# EAGLE design icehax40 (EAGLE 9.6.2)
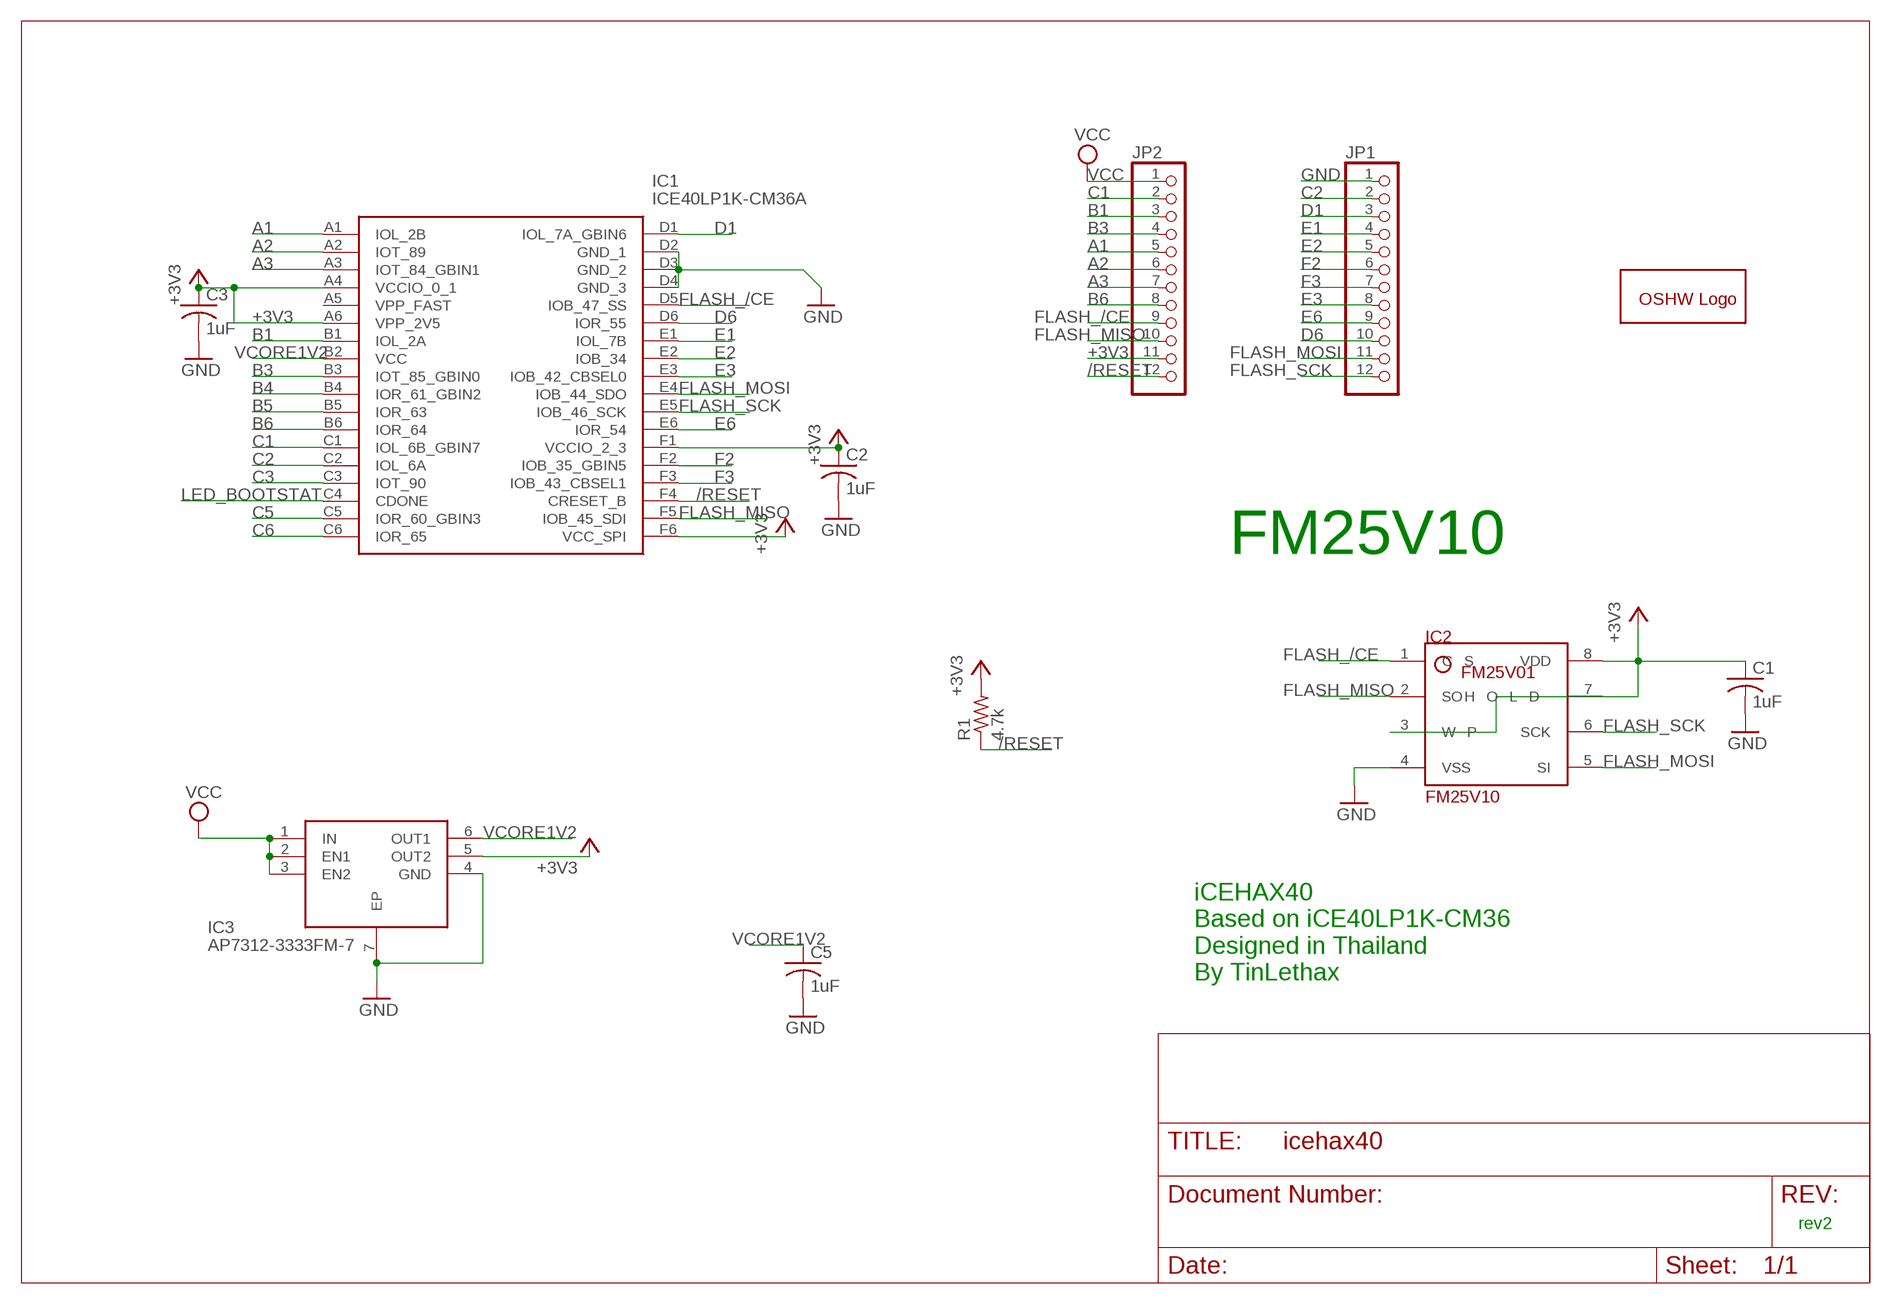
[diagram p0: schematic, sheet 1]

## Parts
C1  1uF  C-USC0603  [C0603]
C2  1uF  C-USC0603  [C0603]
C3  1uF  C-USC0603  [C0603]
C5  1uF  C-USC0603  [C0603]
GOLD_ORB_SM1  OSHWLOGOLOGO5MM  [OSHW_5MM]
IC1  ICE40LP1K-CM36A  [BGA36C40P6X6_250X250X100]
IC2  FM25V10  FM25V01  [SOIC127P601X172-8N]
IC3  AP7312-3333FM-7  [SON50P201X181X60-7N]
JP1  PINHD-1X12  [1X12]
JP2  PINHD-1X12  [1X12]
R1  4.7k  R-US_R0603  [R0603]

## Nets
+3V3: C1.1 C2.1 C3.1 IC1.A4(VCCIO_0_1) IC1.A6(VPP_2V5) IC1.F1(VCCIO_2_3) IC1.F6(VCC_SPI) IC2.3(W̅P̅) IC2.7(H̅O̅L̅D̅) IC2.8(VDD) IC3.5(OUT2) JP2.11 R1.2
/RESET: IC1.F4(CRESET_B) JP2.12 R1.1
A1: IC1.A1(IOL_2B) JP2.5
A2: IC1.A2(IOT_89) JP2.6
A3: IC1.A3(IOT_84_GBIN1) JP2.7
B1: IC1.B1(IOL_2A) JP2.3
B3: IC1.B3(IOT_85_GBIN0) JP2.4
B4: IC1.B4(IOR_61_GBIN2)
B5: IC1.B5(IOR_63)
B6: IC1.B6(IOR_64) JP2.8
C1: IC1.C1(IOL_6B_GBIN7) JP2.2
C2: IC1.C2(IOL_6A) JP1.2
C3: IC1.C3(IOT_90)
C5: IC1.C5(IOR_60_GBIN3)
C6: IC1.C6(IOR_65)
D1: IC1.D1(IOL_7A_GBIN6) JP1.3
D6: IC1.D6(IOR_55) JP1.10
E1: IC1.E1(IOL_7B) JP1.4
E2: IC1.E2(IOB_34) JP1.5
E3: IC1.E3(IOB_42_CBSEL0) JP1.8
E6: IC1.E6(IOR_54) JP1.9
F2: IC1.F2(IOB_35_GBIN5) JP1.6
F3: IC1.F3(IOB_43_CBSEL1) JP1.7
FLASH_/CE: IC1.D5(IOB_47_SS) IC2.1(C̅S̅) JP2.9
FLASH_MISO: IC1.F5(IOB_45_SDI) IC2.2(SO) JP2.10
FLASH_MOSI: IC1.E4(IOB_44_SDO) IC2.5(SI) JP1.11
FLASH_SCK: IC1.E5(IOB_46_SCK) IC2.6(SCK) JP1.12
GND: C1.2 C2.2 C3.2 C5.2 IC1.D2(GND_1) IC1.D3(GND_2) IC1.D4(GND_3) IC2.4(VSS) IC3.4(GND) IC3.7(EP) JP1.1
LED_BOOTSTAT: IC1.C4(CDONE)
VCC: IC3.1(IN) IC3.2(EN1) IC3.3(EN2) JP2.1
VCORE1V2: C5.1 IC1.B2(VCC) IC3.6(OUT1)
Unconnected: IC1.A5(VPP_FAST)

## Notes on the sheet
- FM25V10
- iCEHAX40
  Based on iCE40LP1K-CM36
  Designed in Thailand
  By TinLethax
- rev2

## Library data of the parts
C1-C3 C5 = adafruit:C-US: CAPACITOR, American symbol
GOLD_ORB_SM1 = oshw:OSHWLOGO: The OSHW logo for PCB layout
IC1 = ICE40LP1K-CM36A:ICE40LP1K-CM36A: iCE40 LP/HX/LM - Low-power, high-performance FPGA Source: Datasheet <http://www.latticesemi.com/iCE40>; DESCRIPTION: iCE40 LP/HX/LM - Low-power, high-performance FPGA; HEIGHT: 1mm; MANUFACTURER_NAME: Lattice Semiconductor; MANUFACTURER_PART_NUMBER: ICE40LP1K-CM36A; MOUSER_PART_NUMBER: 842-ICE40LP1K-CM36A; MOUSER_PRICE-STOCK: https://www.mouser.co.uk/ProductDetail/Lattice/ICE40LP1K-CM36A?qs=w%2Fv1CP2dgqpOjceq4EogWg%3D%3D
IC2 = FM25V01:FM25V01: The FM25V01A is a 128-Kbit nonvolatile memory employing an advanced ferroelectric process. An F-RAM is nonvolatile and performs reads and writes similar to a RAM. It provides reliable data retention for 151 years while eliminating the complexities, overhead, and system-level reliability problems caused by serial flash, EEPROM, and other nonvolatile memories. Unlike serial flash and EEPROM, the FM25V01A performs write operations at bus speed. No write delays are incurred. Data is written to the memory array immediately after each byte is successfully transferred to the device. The next bus cycle can commence without the need for data polling. In addition, the product offers substantial write endurance compared with other nonvolatile memories. The FM25V01A is capable of supporting 1014 read/write cycles, or 100 million times more write cycles than EEPROM.; PARTNO: FM52V01
IC3 = AP7312-3333FM-7:AP7312-3333FM-7: LDO Voltage Regulators Dual 150mA LDO Reg 60uA 3.3 to 3.3 65dB Source: Datasheet <https://componentsearchengine.com/Datasheets/2/AP7312-3333FM-7.pdf>; ARROW_PART_NUMBER: AP7312-3333FM-7; ARROW_PRICE-STOCK: https://www.arrow.com/en/products/ap7312-3333fm-7/diodes-incorporated?region=nac; DESCRIPTION: LDO Voltage Regulators Dual 150mA LDO Reg 60uA 3.3 to 3.3 65dB; HEIGHT: 0.605mm; MANUFACTURER_NAME: Diodes Inc.; MANUFACTURER_PART_NUMBER: AP7312-3333FM-7; MOUSER_PART_NUMBER: 621-AP7312-3333FM-7; MOUSER_PRICE-STOCK: https://www.mouser.co.uk/ProductDetail/Diodes-Incorporated/AP7312-3333FM-7?qs=gfe7vQ8txpUN8cgNVhLSKw%3D%3D
JP1 JP2 = adafruit:PINHD-1X12: PIN HEADER
R1 = adafruit:R-US_: RESISTOR, American symbol

## Board
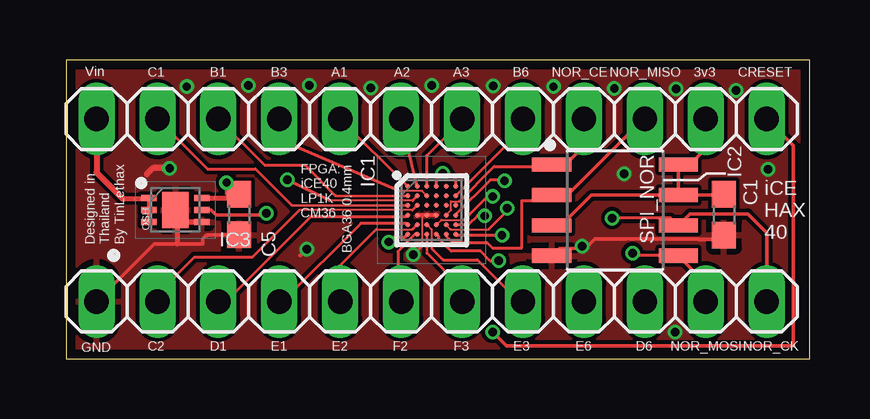
[diagram p1: board, top side]
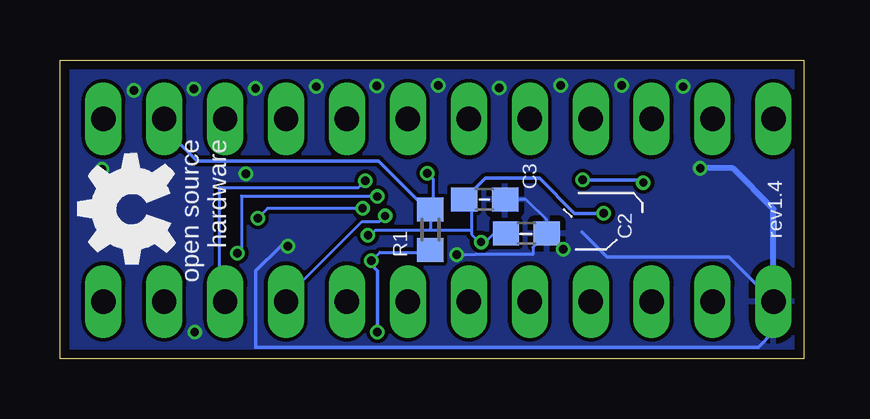
[diagram p2: board, bottom side, seen from below]

Size 31.02 x 12.46 mm. Coordinates in mm from the lower left corner, seen from the top.
Outline: 0,0 31.02,0 31.01,12.46 0,12.46 0,0
Copper layers (1*16): Top 0.035559375mm / dielectric 1.6mm / Bottom 0.035559375mm
Design rules "oshpark-2layer *": minimum track width 6mil, minimum drill 10mil, track to track 6mil, track to pad 6mil, pad to pad 6mil, via to via 6mil, smd to smd 6mil, copper to edge 15mil, drill to drill 6mil, minimum pad ring 5mil, minimum via ring 5mil, stop-mask expansion 0mil, vias tented up to drill 0mil, thermal gap 10mil

### Footprints (pad centres in the part's own frame; a part is rotated, then mirrored left to right if it is on the bottom)
C0603 = smd 1.1 x 1: 1 -0.85,0; 2 0.85,0
BGA36C40P6X6_250X250X100 = smd 0.2 x 0.2: A1 -1,1; A2 -0.6,1; A3 -0.2,1; A4 0.2,1; A5 0.6,1; A6 1,1; B1 -1,0.6; B2 -0.6,0.6; B3 -0.2,0.6; B4 0.2,0.6; B5 0.6,0.6; B6 1,0.6; C1 -1,0.2; C2 -0.6,0.2; C3 -0.2,0.2; C4 0.2,0.2; C5 0.6,0.2; C6 1,0.2; D1 -1,-0.2; D2 -0.6,-0.2; D3 -0.2,-0.2; D4 0.2,-0.2; D5 0.6,-0.2; D6 1,-0.2; E1 -1,-0.6; E2 -0.6,-0.6; E3 -0.2,-0.6; E4 0.2,-0.6; E5 0.6,-0.6; E6 1,-0.6; F1 -1,-1; F2 -0.6,-1; F3 -0.2,-1; F4 0.2,-1; F5 0.6,-1; F6 1,-1
SOIC127P601X172-8N = smd 1.641 x 0.602: 1 -2.637,1.905; 2 -2.637,0.635; 3 -2.637,-0.635; 4 -2.637,-1.905; 5 2.637,-1.905; 6 2.637,-0.635; 7 2.637,0.635; 8 2.637,1.905
SON50P201X181X60-7N = smd 0.65 x 0.25: 1 -1.1,0.5; 2 -1.1,0; 3 -1.1,-0.5; 4 1.1,-0.5; 5 1.1,0; 6 1.1,0.5 | smd 1.1 x 1.5: 7 0,0
1X12 = drill 1.016 long: 1 -13.97,0; 2 -11.43,0; 3 -8.89,0; 4 -6.35,0; 5 -3.81,0; 6 -1.27,0; 7 1.27,0; 8 3.81,0; 9 6.35,0; 10 8.89,0; 11 11.43,0; 12 13.97,0
R0603 = smd 1 x 1.1: 1 -0.85,0; 2 0.85,0

### Placement (x,y rotation side)
C1  27.43,6 270 top
C2  11.57,5.22 0 bottom
C3  13.31,6.65 0 bottom
C5  7.21,6.01 270 top
GOLD_ORB_SM1  28.02,6.24 90 bottom
IC1  15.24,6.19 0 top
IC2  22.89,6.19 0 top
IC3  4.56,6.2 0 top
JP1  15.24,2.38 0 top
JP2  15.24,10 0 top
R1  15.57,5.38 90 bottom

### Tracks (layer width: path | path; a pad name or v marks a point on that pad's centre or on a via)
+3V3  (via drill 0.35)
  Top 0.127: IC1.F6 16.3,5.13 18.15,5.13 v18.17,5.16 | v13.46,4.87 13.68,5.08 14.13,5.08 IC1.F1 | IC1.A4 15.44,7.48 v15.7,7.74 15.97,7.74 16.24,7.47 IC1.A6
  Top 0.152: IC2.3 20.33,5.64 20.72,5.64 21.91,6.83 IC2.7 | IC2.7 IC2.8 26.01,8.1 26.61,8.69 | IC2.7 27.41,6.83 C1.1 | 26.61,9.94 JP2.11 | IC3.5 6.06,6.2 6.26,6 8.28,6 v8.34,6.06
  Top 0.254: 26.61,9.94 26.61,8.69
  Bottom 0.127: v18.17,5.16 18.07,5.16 17.87,5.36 15.52,5.36 | 15.52,5.36 13.85,5.36 | v15.7,7.74 15.47,7.51 15.47,6.33 R1.2 15.57,5.41 15.52,5.36 | C3.1 13.85,6.34 13.85,5.36 | 13.85,5.36 13.85,5.18 13.54,4.87 v13.46,4.87 13.28,4.87 12.93,5.22 C2.1
  Bottom 0.152: R1.2 15.71,6.23 17.73,8.25 25.3,8.25 26.67,9.62 JP2.11 | v8.34,6.06 9.56,6.06 11.02,7.52 13.28,7.52 C3.1
/RESET  (via drill 0.35)
  Top 0.127: IC1.F4 15.52,5.11 15.52,5.02 16.05,4.49 17.27,4.49 17.68,4.08 v18.03,4.08
  Top 0.152: JP2.12 30.33,8.88 30.33,0.53 18.36,0.53 v17.78,1.11
  Bottom 0.127: v18.03,4.08 17.68,4.44 15.66,4.44 R1.1
  Bottom 0.152: v18.03,4.08 18.03,3.91 17.78,3.65 v17.78,1.11
A1
  Top 0.127: IC1.A1 JP2.5
A2
  Top 0.127: 13.95,9.98 JP2.6 IC1.A2
A3
  Top 0.102: JP2.7 16.51,9.95
  Top 0.127: 16.51,9.95 15.04,8.48 IC1.A3
B1
  Top 0.102: IC1.B1 11.24,6.79
  Top 0.127: JP2.3 8.28,8.07 9.96,8.07 11.24,6.79
B3
  Top 0.089: 14.84,6.99 13.89,6.99
  Top 0.102: IC1.B3 14.84,6.99
  Top 0.127: 13.89,6.99 9.65,8.81 8.89,9.57 JP2.4
B6
  Top 0.127: IC1.B6 19.05,9.6 JP2.8
C1
  Top 0.102: 9.42,6.39 14.16,6.39
  Top 0.127: IC1.C1 14.16,6.39 | JP2.2 5.89,7.92 7.9,7.92 9.42,6.39
C2
  Top 0.089: 14.44,6.19 9.73,6.19
  Top 0.127: IC1.C2 14.44,6.19 | JP1.2 3.81,2.69 5.36,4.24 7.77,4.24 9.73,6.19
D1
  Top 0.127: IC1.D1 14.16,5.91 10.2,5.91 6.67,2.38 JP1.3
D6  (via drill 0.35)
  Top 0.127: IC1.D6 16.24,6.01 17.68,7.45 18.25,7.45 v18.28,7.43
  Bottom 0.127: v18.28,7.43 18.56,7.14 24.37,7.14 24.37,2.62 JP1.10
E1
  Top 0.127: IC1.E1 14.19,5.65 12.29,5.65 9.03,2.38 JP1.4
E2
  Top 0.089: 12.93,5.39 14.44,5.39
  Top 0.127: JP1.5 11.43,3.89 12.93,5.39 | 14.44,5.39 IC1.E2
E3
  Top 0.089: 15.24,5.39 15.24,4.6
  Top 0.102: IC1.E3 15.24,5.39
  Top 0.127: JP1.8 18.89,2.38 17.14,4.13 15.72,4.13 15.24,4.6
E6  (via drill 0.35)
  Top 0.127: v17.46,5.95 17.14,5.95 16.78,5.59 IC1.E6
  Bottom 0.127: v17.46,5.95 17.7,5.71 18.44,5.71 21.59,2.56 JP1.9
F2
  Top 0.127: JP1.6 13.84,2.51 13.84,4.47 14.56,5.19 IC1.F2
F3
  Top 0.102: IC1.F3 15.04,4.41
  Top 0.127: 16.51,2.46 JP1.7 16.43,2.46 16.43,3.02 15.04,4.41
FLASH_/CE
  Top 0.089: 16.04,6.19 16.04,6.56 16.39,6.56
  Top 0.102: IC1.D5 16.04,6.19
  Top 0.127: IC2.1 20.17,8.02 17.85,8.02 16.39,6.56
  Top 0.152: JP2.9 21.59,8.86 20.83,8.1 IC2.1
FLASH_MISO
  Top 0.127: IC1.F5 15.84,5.12 16.11,4.85 17.55,4.85 17.77,4.63 19.01,4.63 19.01,6.59 20.01,6.59 IC2.2
  Top 0.152: IC2.2 20.29,6.79 20.86,6.79 24.08,10 JP2.10
FLASH_MOSI  (via drill 0.35)
  Top 0.089: 15.64,5.79 16.59,5.79
  Top 0.102: IC1.E4 15.64,5.79
  Top 0.127: 16.59,5.79 17.56,6.77 v17.78,6.77 v17.79,6.77 | v23.61,4.41 23.72,4.3 25.51,4.3 IC2.5
  Top 0.152: IC2.5 26.67,3.14 JP1.11
  Bottom 0.127: v17.79,6.77 17.81,6.79 23.45,6.79 23.45,4.57 v23.61,4.41
FLASH_SCK  (via drill 0.35)
  Top 0.089: 16.04,5.39 17.62,5.39
  Top 0.102: IC1.E5 16.04,5.39
  Top 0.127: v22.77,5.86 25.22,5.86 IC2.6 | 17.62,5.39 18.4,6.18 v18.4,6.27
  Top 0.152: IC2.6 26.01,6.04 28.42,6.04 29.21,5.25 JP1.12
  Bottom 0.127: v18.4,6.27 22.36,6.27 v22.77,5.86
GND  (via drill 0.35)
  Top 0.089: 14.84,5.99 14.84,4.71
  Top 0.127: 14.84,4.71 v14.47,4.34
  Top 0.152: IC1.D2 14.84,5.99 IC1.D3 IC1.D4 | IC2.4 20.57,4.6 21.51,4.6 v21.51,4.68 21.73,4.68 22.05,5 26.36,5 26.39,4.97 27.25,4.97 C1.2 | JP1.1 3.68,4.79 4.62,4.79 5.69,4.79 5.69,5 5.83,5.14 5.89,5.14 5.89,5.16 C5.2 | v10.03,4.57 9.78,4.31 9.75,4.31
  Top 0.203: IC3.4 5.06,5.7 IC3.7 4.62,6.14 4.62,4.79
  Top 0.254: v4.32,7.94 3.61,7.94 3.38,7.72 3.38,7.69
  Bottom 0.127: v14.47,4.34 13.69,4.34 11.3,4.34 11.3,4.64 C2.2 | C2.2 10.72,5.78 11.6,6.65 C3.2 | C2.2 10.77,5.17
  Bottom 0.152: v21.51,4.68 21.83,4.68 22.86,3.65 22.86,0.48 1.91,0.48 1.27,1.11 JP1.1 3.12,4.24 8.2,4.24 9.26,5.29 | 10.45,5.5 C2.2 10.07,4.57 v10.03,4.57
  Bottom 0.254: JP1.1 1.27,6.24 2.97,7.94 v4.32,7.94
  other vias: 25.4,1.11 29.26,7.89 23.27,7.72 12.7,11.3 5.03,11.35 7.59,11.4 10.13,11.4 15.24,11.4 17.81,11.37 20.32,11.35 22.86,11.27 25.43,11.25 27.94,11.2
  pour Top: 0,12.46 0,0 31.04,0 31.04,12.46
  pour Bottom: 0,12.46 0,0 31.04,0 31.04,12.46
VCC
  Top 0.203: 2.36,6.67 3.43,6.67 IC3.1 IC3.2 IC3.3
  Top 0.254: JP2.1 1.27,7.77 2.36,6.67
VCORE1V2  (via drill 0.35)
  Top 0.089: 14.45,6.59 10.98,6.59
  Top 0.127: IC1.B2 14.45,6.59 | 10.98,6.59 v9.22,7.46
  Top 0.152: 6.69,6.86 v6.69,7.35 6.73,7.35 C5.1
  Top 0.203: IC3.6 7.05,6.7 C5.1
  Bottom 0.152: v9.22,7.46 6.81,7.46 v6.69,7.35

### Text on the board
tNames: Vin | C1 | B1 | B3 | A1 | A2 | A3 | B6 | NOR_CE | NOR_MISO | 3v3 | CRESET | FPGA: / iCE40 / LP1K / CM36 | Designed in / Thailand / By TinLethax | OSH | SPI_NOR | iCE / HAX / 40 | BGA36 0.4mm | GND | C2 | D1 | E1 | E2 | F2 | F3 | E3 | E6 | D6 | NOR_MOSI | NOR_CK
bNames: rev1.4